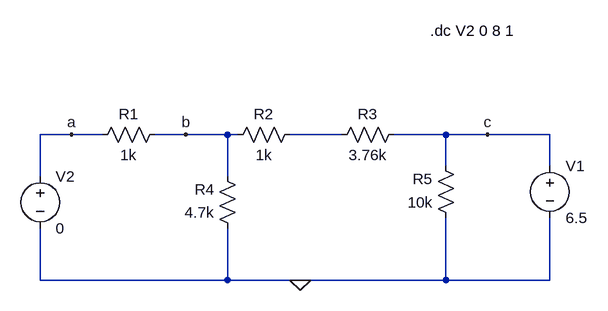
[diagram p0: schematic 250_CW3.asc]
250_CW3.asc, the LTspice schematic file:
Version 4
SHEET 1 880 680
WIRE -96 96 -144 96
WIRE -48 96 -96 96
WIRE 80 96 32 96
WIRE 144 96 80 96
WIRE 160 96 144 96
WIRE 320 96 240 96
WIRE 480 96 400 96
WIRE 544 96 480 96
WIRE 640 96 544 96
WIRE 480 144 480 96
WIRE 640 144 640 96
WIRE -144 160 -144 96
WIRE 144 160 144 96
WIRE -144 320 -144 240
WIRE 144 320 144 240
WIRE 144 320 -144 320
WIRE 256 320 144 320
WIRE 480 320 480 224
WIRE 480 320 256 320
WIRE 640 320 640 224
WIRE 640 320 480 320
FLAG 256 320 0
FLAG -96 96 a
FLAG 80 96 b
FLAG 544 96 c
SYMBOL res -64 112 R270
WINDOW 0 32 56 VTop 2
WINDOW 3 0 56 VBottom 2
SYMATTR InstName R1
SYMATTR Value 1k
SYMBOL res 256 80 R90
WINDOW 0 0 56 VBottom 2
WINDOW 3 32 56 VTop 2
SYMATTR InstName R2
SYMATTR Value 1k
SYMBOL res 416 80 R90
WINDOW 0 0 56 VBottom 2
WINDOW 3 32 56 VTop 2
SYMATTR InstName R3
SYMATTR Value 3.76k
SYMBOL res 160 256 R180
WINDOW 0 36 76 Left 2
WINDOW 3 36 40 Left 2
SYMATTR InstName R4
SYMATTR Value 4.7k
SYMBOL res 496 240 R180
WINDOW 0 36 76 Left 2
WINDOW 3 36 40 Left 2
SYMATTR InstName R5
SYMATTR Value 10k
SYMBOL voltage 640 128 R0
WINDOW 123 0 0 Left 0
WINDOW 39 0 0 Left 0
SYMATTR InstName V1
SYMATTR Value 6.5
SYMBOL voltage -144 144 R0
WINDOW 123 0 0 Left 0
WINDOW 39 0 0 Left 0
SYMATTR InstName V2
SYMATTR Value 0
TEXT 456 -64 Left 2 !.dc V2 0 8 1

The netlist it stands for:
* 250_CW3.asc
R1 a b 1k
R2 N001 b 1k
R3 c N001 3.76k
R4 0 b 4.7k
R5 0 c 10k
V1 c 0 6.5
V2 a 0 0
.dc V2 0 8 1
.backanno
.end